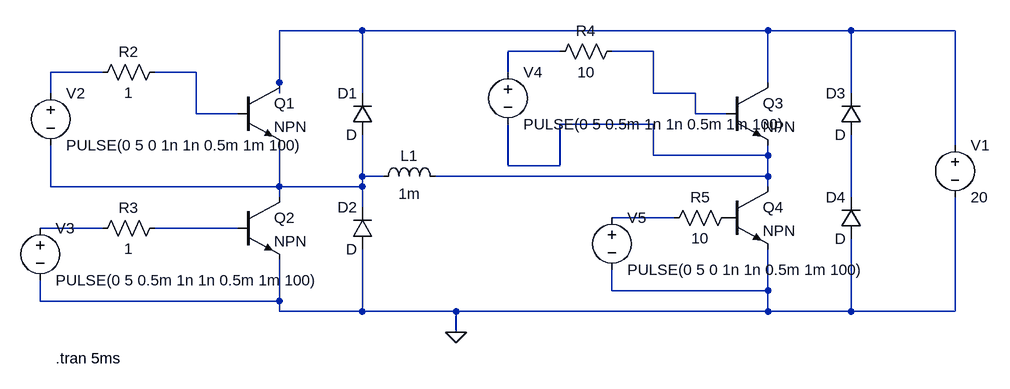
[diagram p0: schematic FullWaveInverter_L.asc]
FullWaveInverter_L.asc, the LTspice schematic file:
Version 4
SHEET 1 1212 680
WIRE 240 96 112 96
WIRE 864 96 240 96
WIRE 992 96 864 96
WIRE 1152 96 992 96
WIRE 544 128 464 128
WIRE 688 128 624 128
WIRE -160 160 -240 160
WIRE -16 160 -80 160
WIRE 464 160 464 128
WIRE 112 176 112 96
WIRE 864 176 864 96
WIRE -240 192 -240 160
WIRE 112 192 112 176
WIRE 240 192 240 96
WIRE 688 192 688 128
WIRE 752 192 688 192
WIRE 992 192 992 96
WIRE -16 224 -16 160
WIRE 48 224 -16 224
WIRE 752 224 752 192
WIRE 800 224 752 224
WIRE 688 240 544 240
WIRE 1152 272 1152 96
WIRE 688 288 688 240
WIRE 864 288 864 272
WIRE 864 288 688 288
WIRE 464 304 464 240
WIRE 544 304 544 240
WIRE 544 304 464 304
WIRE 240 320 240 256
WIRE 272 320 240 320
WIRE 864 320 864 288
WIRE 864 320 352 320
WIRE -240 336 -240 272
WIRE 112 336 112 272
WIRE 112 336 -240 336
WIRE 240 336 240 320
WIRE 240 336 112 336
WIRE 864 336 864 320
WIRE 112 352 112 336
WIRE 992 352 992 256
WIRE 240 368 240 336
WIRE 720 384 624 384
WIRE -160 400 -256 400
WIRE 48 400 -80 400
WIRE 624 496 624 464
WIRE 864 496 864 432
WIRE 864 496 624 496
WIRE -256 512 -256 480
WIRE 112 512 112 448
WIRE 112 512 -256 512
WIRE 112 528 112 512
WIRE 240 528 240 432
WIRE 240 528 112 528
WIRE 384 528 240 528
WIRE 864 528 864 496
WIRE 864 528 384 528
WIRE 992 528 992 416
WIRE 992 528 864 528
WIRE 1152 528 1152 352
WIRE 1152 528 992 528
WIRE 384 560 384 528
FLAG 384 560 0
SYMBOL diode 256 256 R180
WINDOW 0 24 64 Left 2
WINDOW 3 24 0 Left 2
SYMATTR InstName D1
SYMBOL diode 256 432 R180
WINDOW 0 24 64 Left 2
WINDOW 3 24 0 Left 2
SYMATTR InstName D2
SYMBOL diode 1008 256 R180
WINDOW 0 24 64 Left 2
WINDOW 3 24 0 Left 2
SYMATTR InstName D3
SYMBOL diode 1008 416 R180
WINDOW 0 24 64 Left 2
WINDOW 3 24 0 Left 2
SYMATTR InstName D4
SYMBOL npn 48 176 R0
SYMATTR InstName Q1
SYMBOL npn 48 352 R0
SYMATTR InstName Q2
SYMBOL npn 800 176 R0
SYMATTR InstName Q3
SYMBOL npn 800 336 R0
SYMATTR InstName Q4
SYMBOL voltage 1152 256 R0
SYMATTR InstName V1
SYMATTR Value 20
SYMBOL voltage -240 176 R0
SYMATTR InstName V2
SYMATTR Value PULSE(0 5 0 1n 1n 0.5m 1m 100)
SYMBOL voltage -256 384 R0
SYMATTR InstName V3
SYMATTR Value PULSE(0 5 0.5m 1n 1n 0.5m 1m 100)
SYMBOL res -64 144 R90
WINDOW 0 0 56 VBottom 2
WINDOW 3 32 56 VTop 2
SYMATTR InstName R2
SYMATTR Value 1
SYMBOL res -176 416 R270
WINDOW 0 32 56 VTop 2
WINDOW 3 0 56 VBottom 2
SYMATTR InstName R3
SYMATTR Value 1
SYMBOL voltage 464 144 R0
SYMATTR InstName V4
SYMATTR Value PULSE(0 5 0.5m 1n 1n 0.5m 1m 100)
SYMBOL res 640 112 R90
WINDOW 0 0 56 VBottom 2
WINDOW 3 32 56 VTop 2
SYMATTR InstName R4
SYMATTR Value 10
SYMBOL voltage 624 368 R0
SYMATTR InstName V5
SYMATTR Value PULSE(0 5 0 1n 1n 0.5m 1m 100)
SYMBOL res 704 400 R270
WINDOW 0 32 56 VTop 2
WINDOW 3 0 56 VBottom 2
SYMATTR InstName R5
SYMATTR Value 10
SYMBOL ind 256 336 R270
WINDOW 0 32 56 VTop 2
WINDOW 3 5 56 VBottom 2
SYMATTR InstName L1
SYMATTR Value 1m
TEXT -232 600 Left 2 !.tran 5ms

The netlist it stands for:
* FullWaveInverter_L.asc
D1 N007 N001 D
D2 0 N007 D
D3 N008 N001 D
D4 0 N008 D
Q1 N001 N005 N007 0 NPN
Q2 N007 N011 0 0 NPN
Q3 N001 N003 N006 0 NPN
Q4 N006 P001 0 0 NPN
V1 N001 0 20
V2 N004 N007 PULSE(0 5 0 1n 1n 0.5m 1m 100)
V3 N010 0 PULSE(0 5 0.5m 1n 1n 0.5m 1m 100)
R2 N005 N004 1
R3 N010 N011 1
V4 N002 N006 PULSE(0 5 0.5m 1n 1n 0.5m 1m 100)
R4 N003 N002 10
V5 N009 0 PULSE(0 5 0 1n 1n 0.5m 1m 100)
R5 N009 P001 10
L1 N007 N006 1m
.model D D
.lib standard.dio
.model NPN NPN
.model PNP PNP
.lib standard.bjt
.tran 5ms
.backanno
.end